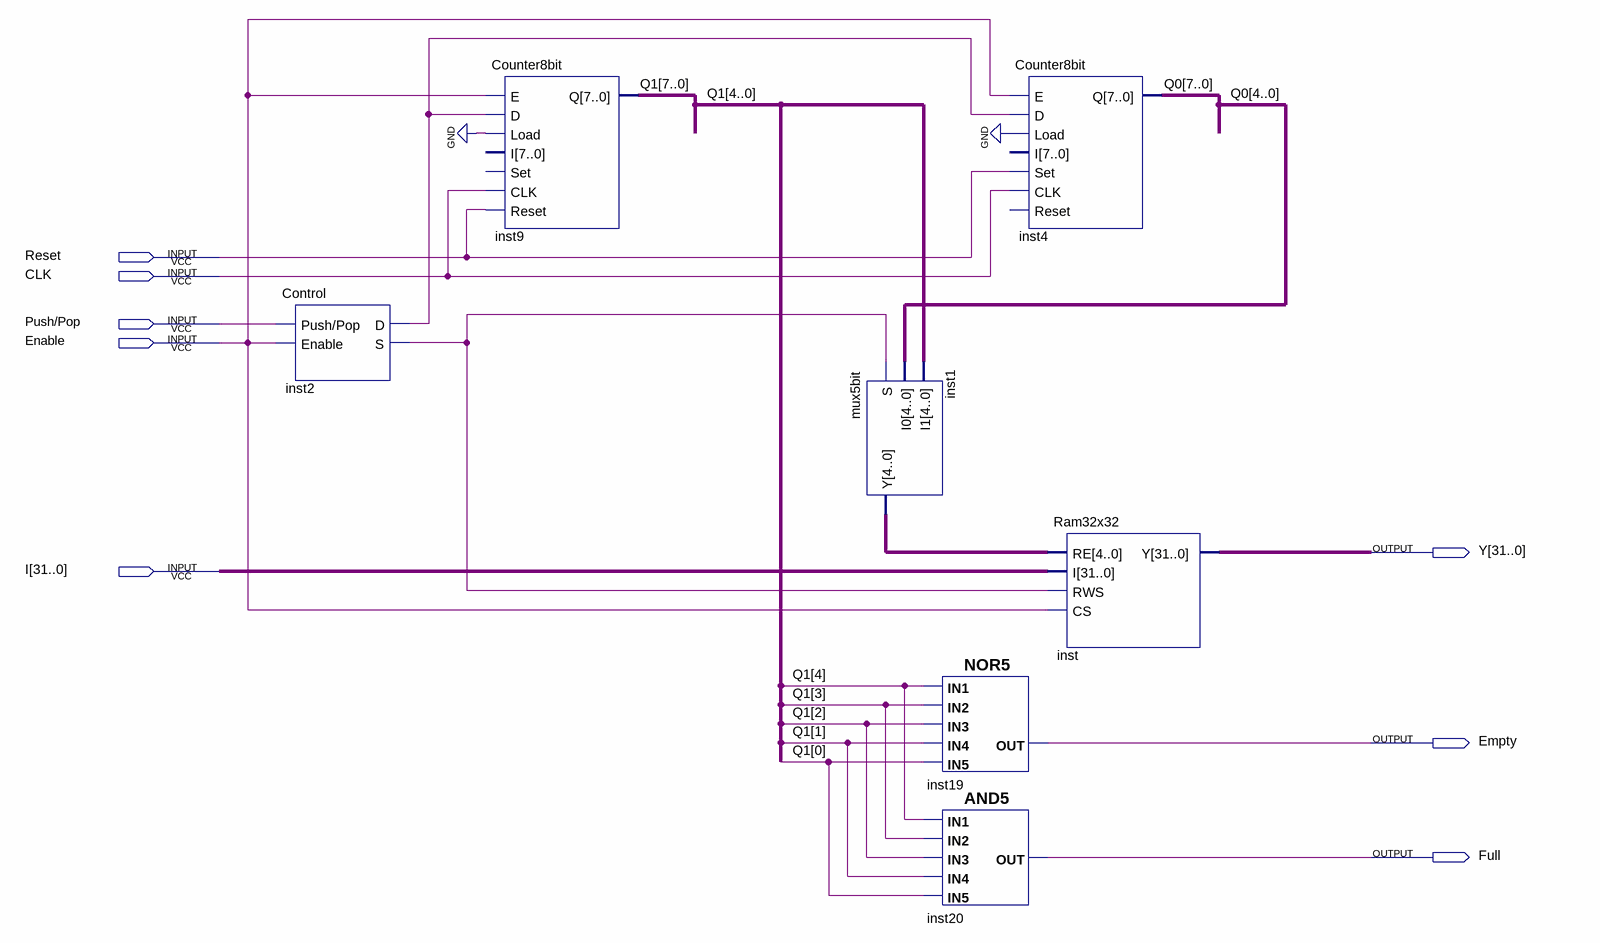
[diagram p0: schematic sheet]
// Quartus schematic STACK.bdf as structural Verilog: 7 symbols, 8 pins
module STACK (
  input  Reset,
  input  CLK,
  input  \Push/Pop ,
  input  Enable,
  input  [31:0] I,
  output [31:0] Y,
  output Empty,
  output Full
);

  wire inst2_d, inst2_s;
  wire [4:0] inst1_y;
  wire [7:0] Q0, Q1;

  Control inst2 (.\Push/Pop (\Push/Pop ), .Enable(Enable), .D(inst2_d), .S(inst2_s));
  Counter8bit inst9 (.E(Enable), .D(inst2_d), .Load(1'b0), .CLK(CLK), .Reset(Reset), .Q(Q1));  // open: I, Set
  mux5bit inst1 (.S(inst2_s), .I0(Q0[4:0]), .I1(Q1[4:0]), .Y(inst1_y));
  nor inst19 (Empty, Q1[4], Q1[3], Q1[2], Q1[1], Q1[0]);
  and inst20 (Full, Q1[4], Q1[3], Q1[2], Q1[1], Q1[0]);
  Counter8bit inst4 (.E(Enable), .D(inst2_d), .Load(1'b0), .Set(Reset), .CLK(CLK), .Q(Q0));  // open: I, Reset
  Ram32x32 inst (.RE(inst1_y), .I(I), .RWS(inst2_s), .CS(Enable), .Y(Y));
endmodule
